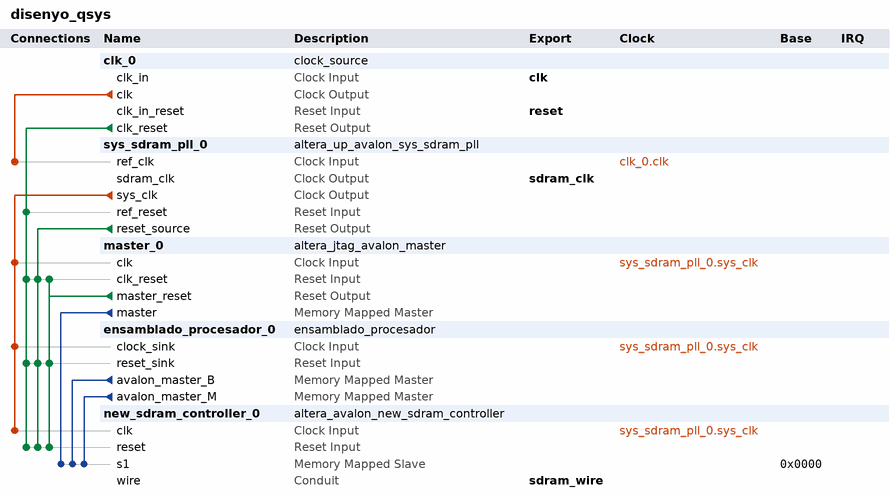
[diagram p0: system contents]
# Platform Designer (Qsys) system disenyo_qsys, Cyclone IV E EP4CE115F29C7
# Parameters at their usual value, and those the tool derives, are not listed.
package require -exact qsys 19.1
create_system disenyo_qsys
set_project_property DEVICE_FAMILY {Cyclone IV E}
set_project_property DEVICE EP4CE115F29C7

add_instance clk_0 clock_source 19.1
set_instance_parameter_value clk_0 clockFrequency 50000000

add_instance sys_sdram_pll_0 altera_up_avalon_sys_sdram_pll 18.0
set_instance_parameter_value sys_sdram_pll_0 CV_boards DE10-Standard
set_instance_parameter_value sys_sdram_pll_0 gui_outclk 50.0
set_instance_parameter_value sys_sdram_pll_0 gui_refclk 50.0

add_instance master_0 altera_jtag_avalon_master 19.1

add_instance ensamblado_procesador_0 ensamblado_procesador 1.0

add_instance new_sdram_controller_0 altera_avalon_new_sdram_controller 19.1
set_instance_parameter_value new_sdram_controller_0 TAC 5.5
set_instance_parameter_value new_sdram_controller_0 TRCD 20.0
set_instance_parameter_value new_sdram_controller_0 TRP 20.0
set_instance_parameter_value new_sdram_controller_0 casLatency 3
set_instance_parameter_value new_sdram_controller_0 columnWidth 10
set_instance_parameter_value new_sdram_controller_0 dataWidth 32
set_instance_parameter_value new_sdram_controller_0 generateSimulationModel true
set_instance_parameter_value new_sdram_controller_0 model single_Micron_MT48LC4M32B2_7_chip
set_instance_parameter_value new_sdram_controller_0 numberOfBanks 4
set_instance_parameter_value new_sdram_controller_0 numberOfChipSelects 1
set_instance_parameter_value new_sdram_controller_0 powerUpDelay 100.0
set_instance_parameter_value new_sdram_controller_0 refreshPeriod 0.2
set_instance_parameter_value new_sdram_controller_0 rowWidth 13

# connections
add_connection clk_0.clk sys_sdram_pll_0.ref_clk clock
add_connection sys_sdram_pll_0.sys_clk ensamblado_procesador_0.clock_sink clock
add_connection sys_sdram_pll_0.sys_clk master_0.clk clock
add_connection sys_sdram_pll_0.sys_clk new_sdram_controller_0.clk clock
add_connection clk_0.clk_reset ensamblado_procesador_0.reset_sink reset
add_connection clk_0.clk_reset master_0.clk_reset reset
add_connection clk_0.clk_reset new_sdram_controller_0.reset reset
add_connection clk_0.clk_reset sys_sdram_pll_0.ref_reset reset
add_connection master_0.master_reset ensamblado_procesador_0.reset_sink reset
add_connection master_0.master_reset master_0.clk_reset reset
add_connection master_0.master_reset new_sdram_controller_0.reset reset
add_connection sys_sdram_pll_0.reset_source ensamblado_procesador_0.reset_sink reset
add_connection sys_sdram_pll_0.reset_source master_0.clk_reset reset
add_connection sys_sdram_pll_0.reset_source new_sdram_controller_0.reset reset
add_connection ensamblado_procesador_0.avalon_master_B new_sdram_controller_0.s1 avalon
set_connection_parameter_value ensamblado_procesador_0.avalon_master_B/new_sdram_controller_0.s1 baseAddress 0x0000
add_connection ensamblado_procesador_0.avalon_master_M new_sdram_controller_0.s1 avalon
set_connection_parameter_value ensamblado_procesador_0.avalon_master_M/new_sdram_controller_0.s1 baseAddress 0x0000
add_connection master_0.master new_sdram_controller_0.s1 avalon
set_connection_parameter_value master_0.master/new_sdram_controller_0.s1 baseAddress 0x0000

# exported interfaces
add_interface clk clock sink
set_interface_property clk EXPORT_OF clk_0.clk_in
add_interface reset reset sink
set_interface_property reset EXPORT_OF clk_0.clk_in_reset
add_interface sdram_clk clock source
set_interface_property sdram_clk EXPORT_OF sys_sdram_pll_0.sdram_clk
add_interface sdram_wire conduit end
set_interface_property sdram_wire EXPORT_OF new_sdram_controller_0.wire

set_interconnect_requirement {$system} qsys_mm.clockCrossingAdapter HANDSHAKE
set_interconnect_requirement {$system} qsys_mm.enableEccProtection FALSE
set_interconnect_requirement {$system} qsys_mm.insertDefaultSlave FALSE
set_interconnect_requirement {$system} qsys_mm.maxAdditionalLatency 1

save_system disenyo_qsys.qsys
